# Altium schematic sheet POWER_SUPPLY.SchDoc
size A4; SheetNumber: 1; SheetTotal: 3
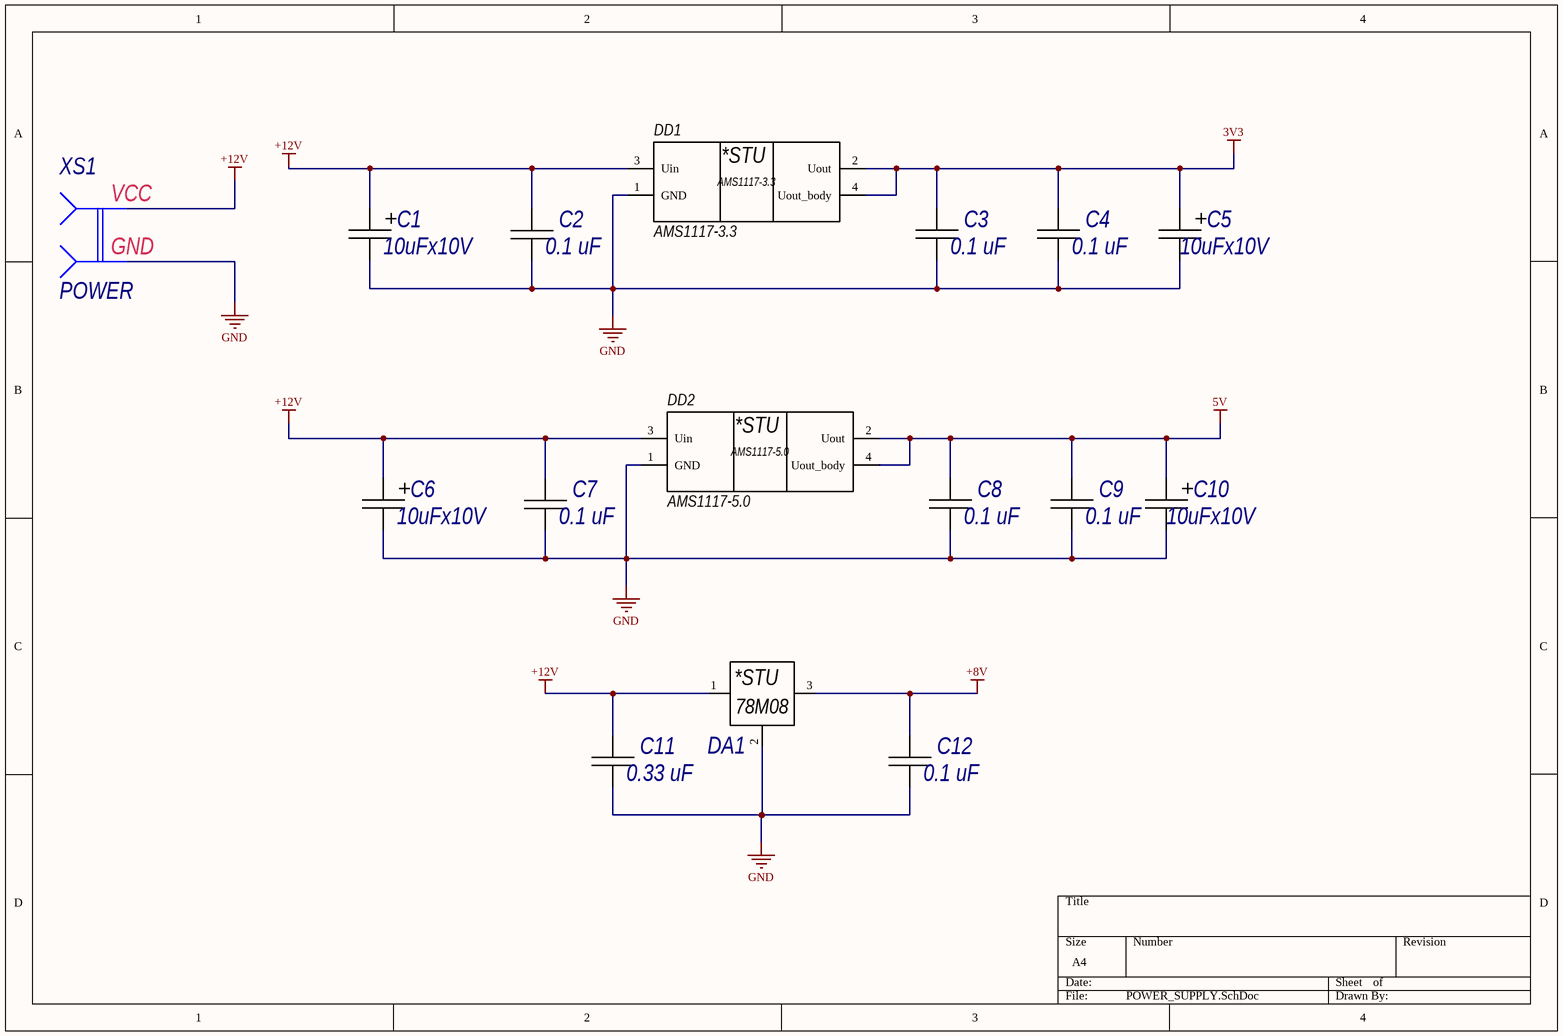
[diagram p0: POWER_SUPPLY.SchDoc]

## Parts
C1  10uFx10V
C2  0.1 uF  [C0805C]
C3  0.1 uF  [C0805C]
C4  0.1 uF  [C0805C]
C5  10uFx10V  [TECAP_D]
C6  10uFx10V
C7  0.1 uF  [C0805C]
C8  0.1 uF  [C0805C]
C9  0.1 uF  [C0805C]
C10  10uFx10V  [TECAP_D]
C11  0.33 uF  [C0805C]
C12  0.1 uF  [C0805C]
DA1  78M08CDT  [SC_TO-252AA]  (value not drawn)
DD1  AMS1117-3.3  [SOT229P700X180-4N]
DD2  AMS1117-5.0  [SOT229P700X180-4N]
XS1  POWER  [DG25C-B-02P-13]

## Nets
3V3: C3.2 C4.2 C5.1 DD1.2(Uout) DD1.4(Uout_body)
5V: C8.2 C9.2 C10.1 DD2.2(Uout) DD2.4(Uout_body)
+8V: C12.2 DA1.3(Out)
+12V: C1.1 C2.2 C6.1 C7.2 C11.2 DA1.1(In) DD1.3(Uin) DD2.3(Uin) XS1.2
GND: C1.2 C2.1 C3.1 C4.1 C5.2 C6.2 C7.1 C8.1 C9.1 C10.2 C11.1 C12.1 DA1.2(GND) DD1.1(GND) DD2.1(GND) XS1.1

## Notes on the sheet
- (in symbol 78M08CDT) *STU; 78M08
- (in symbol AMS1117-3.3) *STU
- (in symbol AMS1117-5.0) *STU
- (in symbol CONNECT_PW) VCC; GND

## Library data of the parts
C1 C5 C6 C10 = CAP_TECAP_A: Type: Конденсатор; Published: 20.08.2010; Publisher: Andrew Danich
C2-C4 C7-C9 C11 C12 = CAP_0805: Type: Конденсатор; Published: 18.05.2010; Publisher: Andrew Danich
DD1 = AMS1117-3.3: Sot223/Pkg 1-Amp 3.3-Volt Low Drop Out Voltage Regulatator; MF: Advanced Monolithic Systems; Price: None; Package: None; Value: *; MP: AMS1117-3.3; Availability: Unavailable; SnapEDA_Link: https://www.snapeda.com/parts/AMS1117-3.3/Advanced%20Monolithic%20Systems/view-part/53450/?ref=snap
DD2 = AMS1117-5.0: Sot223/Pkg 1-Amp 3.3-Volt Low Drop Out Voltage Regulatator; MP: AMS1117-3.3; MF: Advanced Monolithic Systems; Price: None; Package: None; Value: *; Availability: Unavailable; SnapEDA_Link: https://www.snapeda.com/parts/AMS1117-3.3/Advanced%20Monolithic%20Systems/view-part/53450/?ref=snap
XS1 = CONNECT_PW: Value: Connector; Published: 07.03.2013; Publisher: Andrew Danich; Type: Розетка
DA1 = 78M08CDT: Published: 13.08.2015; Publisher: Andrew Danich; Type: Микросхема